# EAGLE design h-bridge driver general AB (EAGLE 7.7.0)
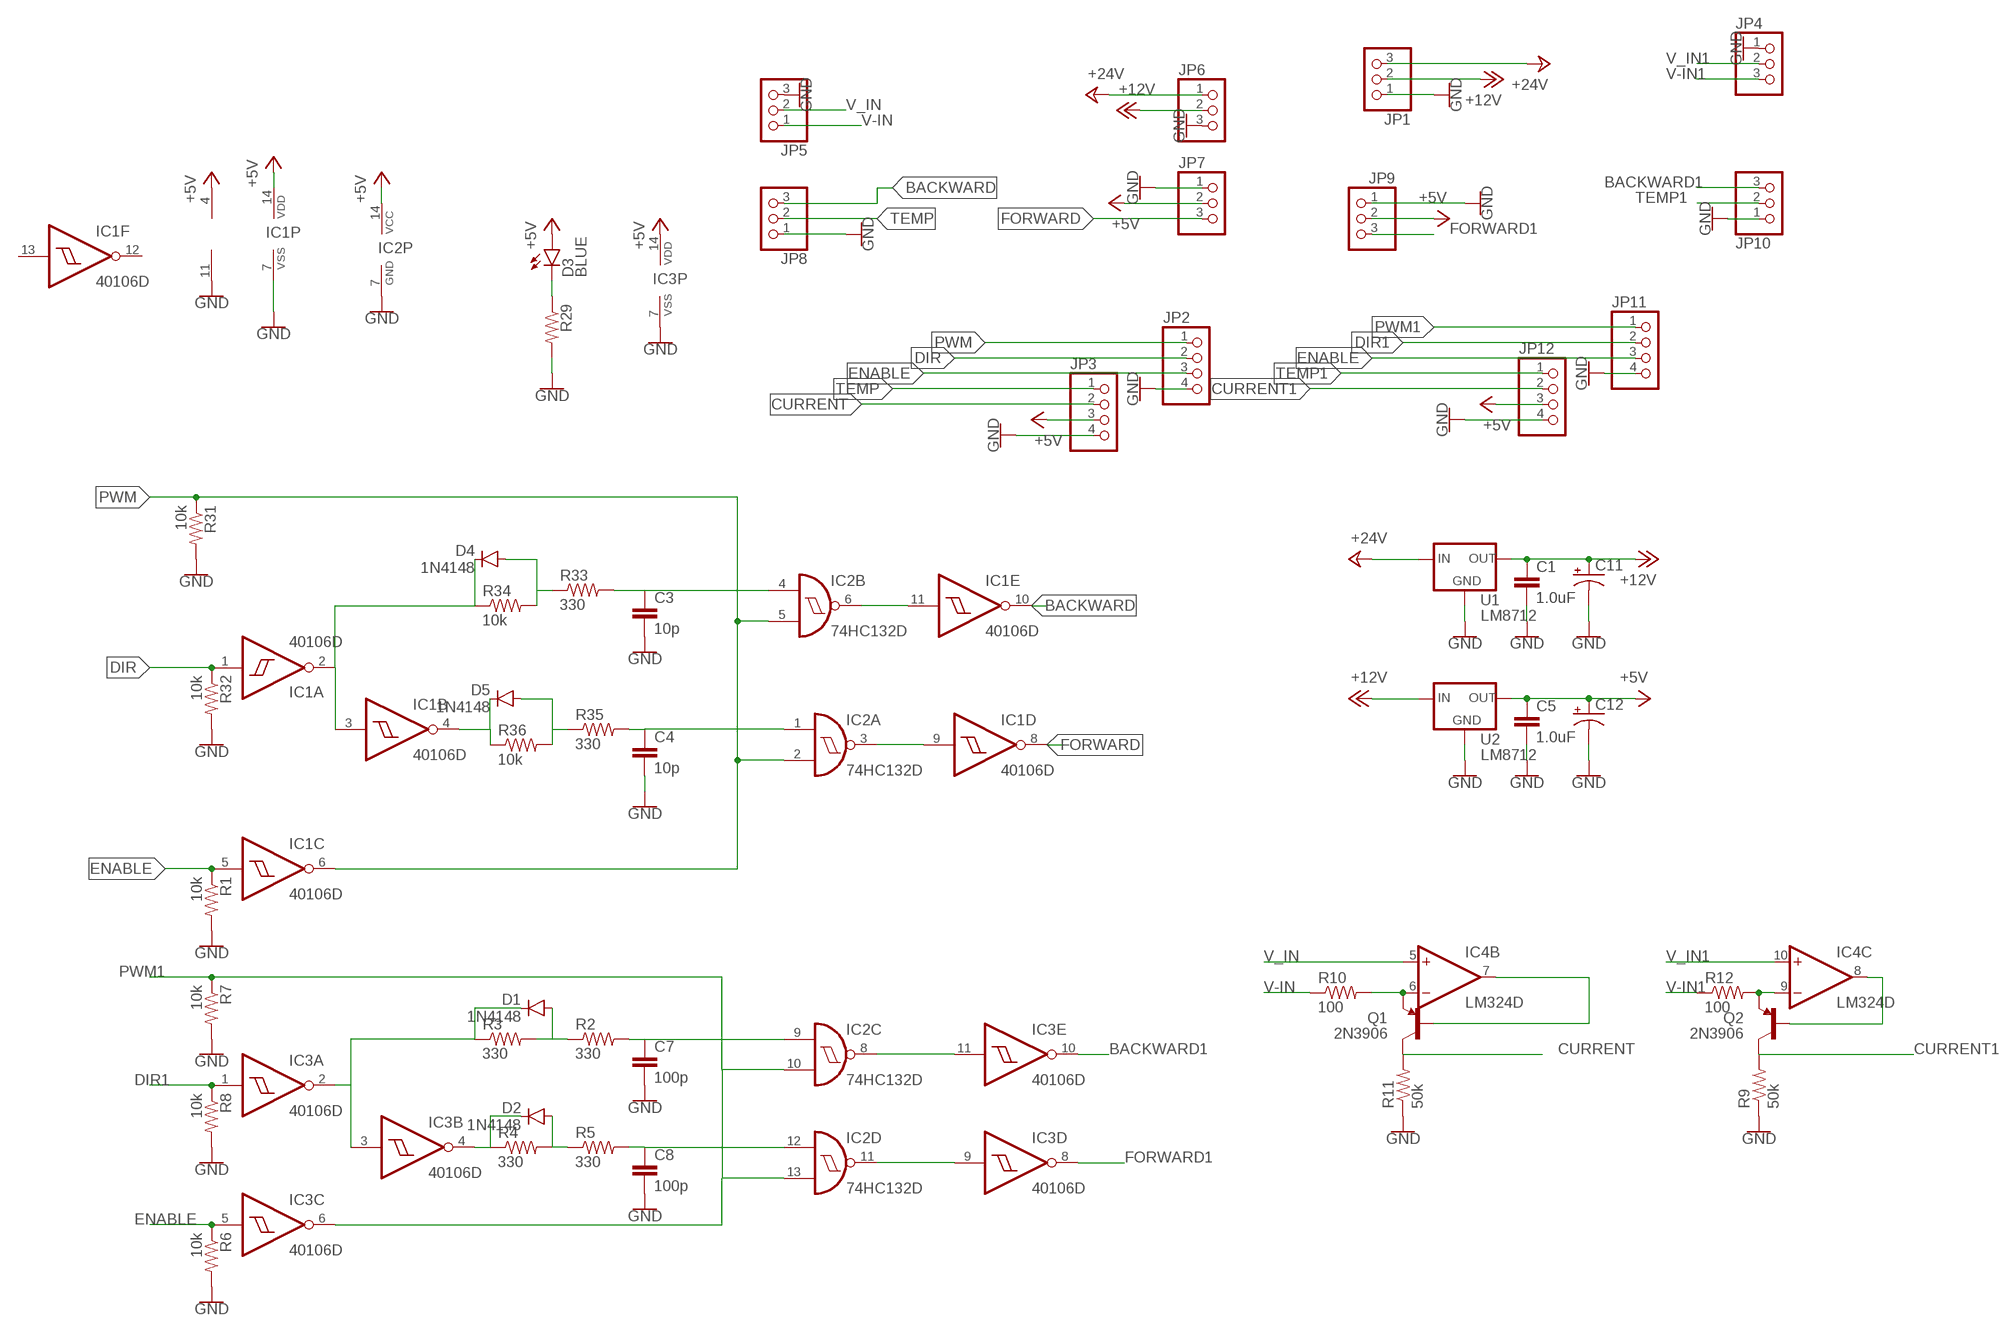
[diagram p0: schematic, sheet 1]

## Parts
C1  1.0uF  1.0UF50V10%(1206)  [1206]
C3  10p  1.0UF-25V-+80/-20(0805)"  [0805-CAP]
C4  10p  1.0UF-25V-+80/-20(0805)"  [0805-CAP]
C5  1.0uF  1.0UF50V10%(1206)  [1206]
C7  100p  1.0UF-25V-+80/-20(0805)"  [0805-CAP]
C8  100p  1.0UF-25V-+80/-20(0805)"  [0805-CAP]
C11  CAP_POLPTH4  [CPOL-RADIAL-1000UF-25V]
C12  CAP_POLPTH4  [CPOL-RADIAL-1000UF-25V]
D1  1N4148  DIODESOD123  [SOD-123]
D2  1N4148  DIODESOD123  [SOD-123]
D3  BLUE  LED-BLUE1206  [LED-1206]
D4  1N4148  DIODESOD123  [SOD-123]
D5  1N4148  DIODESOD123  [SOD-123]
IC1  40106D  [SO14]
IC2  74HC132D  [SO14]
IC3  40106D  [SO14]
IC4  LM324D  [SO14]
JP1  PINHD-1X3  [1X03]
JP2  PINHD-1X4  [1X04]
JP3  PINHD-1X4  [1X04]
JP4  PINHD-1X3  [1X03]
JP5  PINHD-1X3  [1X03]
JP6  PINHD-1X3  [1X03]
JP7  PINHD-1X3  [1X03]
JP8  PINHD-1X3  [1X03]
JP9  PINHD-1X3  [1X03]
JP10  PINHD-1X3  [1X03]
JP11  PINHD-1X4  [1X04]
JP12  PINHD-1X4  [1X04]
Q1  2N3906  TRANSISTOR_PNPMMBT4403  [SOT23-3]
Q2  2N3906  TRANSISTOR_PNPMMBT4403  [SOT23-3]
R1  10k  0.3OHM-1/8W-1%(0805)  [0805]
R2  330  0.3OHM-1/8W-1%(0805)  [0805]
R3  330  0.3OHM-1/8W-1%(0805)  [0805]
R4  330  0.3OHM-1/8W-1%(0805)  [0805]
R5  330  0.3OHM-1/8W-1%(0805)  [0805]
R6  10k  0.3OHM-1/8W-1%(0805)  [0805]
R7  10k  0.3OHM-1/8W-1%(0805)  [0805]
R8  10k  0.3OHM-1/8W-1%(0805)  [0805]
R9  50k  0.3OHM-1/8W-1%(0805)  [0805]
R10  100  0.3OHM-1/8W-1%(0805)  [0805]
R11  50k  0.3OHM-1/8W-1%(0805)  [0805]
R12  100  0.3OHM-1/8W-1%(0805)  [0805]
R29  0.3OHM-1/8W-1%(0805)  [0805]
R31  10k  0.3OHM-1/8W-1%(0805)  [0805]
R32  10k  0.3OHM-1/8W-1%(0805)  [0805]
R33  330  0.3OHM-1/8W-1%(0805)  [0805]
R34  10k  0.3OHM-1/8W-1%(0805)  [0805]
R35  330  0.3OHM-1/8W-1%(0805)  [0805]
R36  10k  0.3OHM-1/8W-1%(0805)  [0805]
U1  LM8712  V_REG_78XXSIDE  [78XXL]
U2  LM8712  V_REG_78XXSIDE  [78XXL]

## Nets
+5V: C5.1 C12.+ D3.A IC1.14(P:VDD) IC2.14(P:VCC) IC3.14(P:VDD) IC4.4(P:V+) JP3.3 JP7.2 JP9.2 JP12.3 U2.OUT
+12V: C1.1 C11.+ JP1.2 JP6.2 U1.OUT U2.IN
+24V: JP1.3 JP6.1 U1.IN
BACKWARD: IC1.10(E:O) JP8.3
BACKWARD1: IC3.10(E:O) JP10.3
CURRENT: JP3.2 Q1.3(C) R11.2
CURRENT1: JP12.2 Q2.3(C) R9.2
DIR: IC1.1(A:I) JP2.2 R32.1
DIR1: IC3.1(A:I) JP11.2 R8.1
ENABLE: IC1.5(C:I) IC3.5(C:I) JP2.3 JP11.3 R1.1 R6.1
FORWARD: IC1.8(D:O) JP7.3
FORWARD1: IC3.8(D:O) JP9.3
GND: C1.2 C3.2 C4.2 C5.2 C7.2 C8.2 C11.- C12.- IC1.7(P:VSS) IC2.7(P:GND) IC3.7(P:VSS) IC4.11(P:V-) JP1.1 JP2.4 JP3.4 JP4.1 JP5.3 JP6.3 JP7.1 JP8.1 JP9.1 JP10.1 JP11.4 JP12.4 R1.2 R6.2 R7.2 R8.2 R9.1 R11.1 R29.2 R31.2 R32.2 U1.GND U2.GND
N$1: IC1.11(E:I) IC2.6(B:O)
N$2: IC1.9(D:I) IC2.3(A:O)
N$3: IC2.8(C:O) IC3.11(E:I)
N$4: IC2.11(D:O) IC3.9(D:I)
N$6: C7.1 IC2.9(C:I0) R2.2
N$7: D3.C R29.1
N$8: D1.A R2.1 R3.2
N$9: D1.C IC3.2(A:O) IC3.3(B:I) R3.1
N$10: IC4.6(B:-IN) Q1.2(E) R10.2
N$11: D2.C IC3.4(B:O) R4.1
N$12: D2.A R4.2 R5.1
N$13: C8.1 IC2.12(D:I0) R5.2
N$14: IC4.7(B:OUT) Q1.1(B)
N$15: IC4.9(C:-IN) Q2.2(E) R12.2
N$17: IC4.8(C:OUT) Q2.1(B)
N$33: D4.C IC1.2(A:O) IC1.3(B:I) R34.1
N$34: D4.A R33.1 R34.2
N$35: C3.1 IC2.4(B:I0) R33.2
N$39: C4.1 IC2.1(A:I0) R35.2
N$40: D5.A R35.1 R36.2
N$41: D5.C IC1.4(B:O) R36.1
PWM: IC1.6(C:O) IC2.2(A:I1) IC2.5(B:I1) JP2.1 R31.1
PWM1: IC2.10(C:I1) IC2.13(D:I1) IC3.6(C:O) JP11.1 R7.1
TEMP: JP3.1 JP8.2
TEMP1: JP10.2 JP12.1
V-IN: JP5.1 R10.1
V-IN1: JP4.3 R12.1
V_IN: IC4.5(B:+IN) JP5.2
V_IN1: IC4.10(C:+IN) JP4.2
Unconnected: IC1.12(F:O) IC1.13(F:I) IC3.12(F:O) IC3.13(F:I) IC4.1(A:OUT) IC4.2(A:-IN) IC4.3(A:+IN) IC4.12(D:+IN) IC4.13(D:-IN) IC4.14(D:OUT)

## Library data of the parts
C1 C5 = SparkFun-Capacitors:1.0UF50V10%(1206): CAP-09822; PROD_ID: CAP-09822
C3 C4 C7 C8 = SparkFun-Capacitors:1.0UF-25V-+80/-20(0805): CAP-11625
C11 C12 = SparkFun-Capacitors:CAP_POL: Capacitor Polarized These are standard SMD and PTH capacitors. Normally 10uF, 47uF, and 100uF in electrolytic and tantalum varieties. Always verify the external diameter of the through hole cap, it varies with capacity, voltage, and manufacturer. The EIA devices should be standard.
D1 D2 D4 D5 = SparkFun-DiscreteSemi:DIODE: Diode These are standard reverse protection diodes and small signal diodes. SMA package can handle up to about 1A. SOD-323 can handle about 200mA. What the SOD-323 package when ordering, there are some mfgs out there that are 5-pin packages.
D3 = SparkFun-LED:LED-BLUE: Blue LEDs for production use Various blue LEDs stocked by SparkFun production 0603 - DIO-08575 Rebel - DIO-09553 1206 - DIO-09911; PROD_ID: DIO-09911
IC1 IC3 = 40xx:40106: Hex SCHMITT TRIGGER
IC2 = 74xx-eu:74*132: Quad 2-input NAND schmitt trigger
IC4 = linear:LM324: OP AMP
JP1 JP4-JP10 = pinhead:PINHD-1X3: PIN HEADER
JP2 JP3 JP11 JP12 = pinhead2:PINHD-1X4: PIN HEADER
Q1 Q2 = SparkFun-DiscreteSemi:TRANSISTOR_PNP: Generic PNP BJT Double check pinouts against datasheets- not all devices are the same! MMBT3906 - 40V 200mA SOT-23 (TRANS-08052) MMBT4403 - 40V 600mA SOT-23 (TRANS-09245); PROD_ID: TRANS-09245; VALUE: MMBT4403
R1-R12 R29 R31-R36 = SparkFun-Resistors:0.3OHM-1/8W-1%(0805): RES-11622; PROD_ID: RES-11622; VALUE: 0.3
U1 U2 = SparkFun-PowerIC:V_REG_78XX: Voltage Regulator Standard 78xx regulator. IGO (Input Ground Output). Spark Fun Electronics SKU : COM-00107

## Board
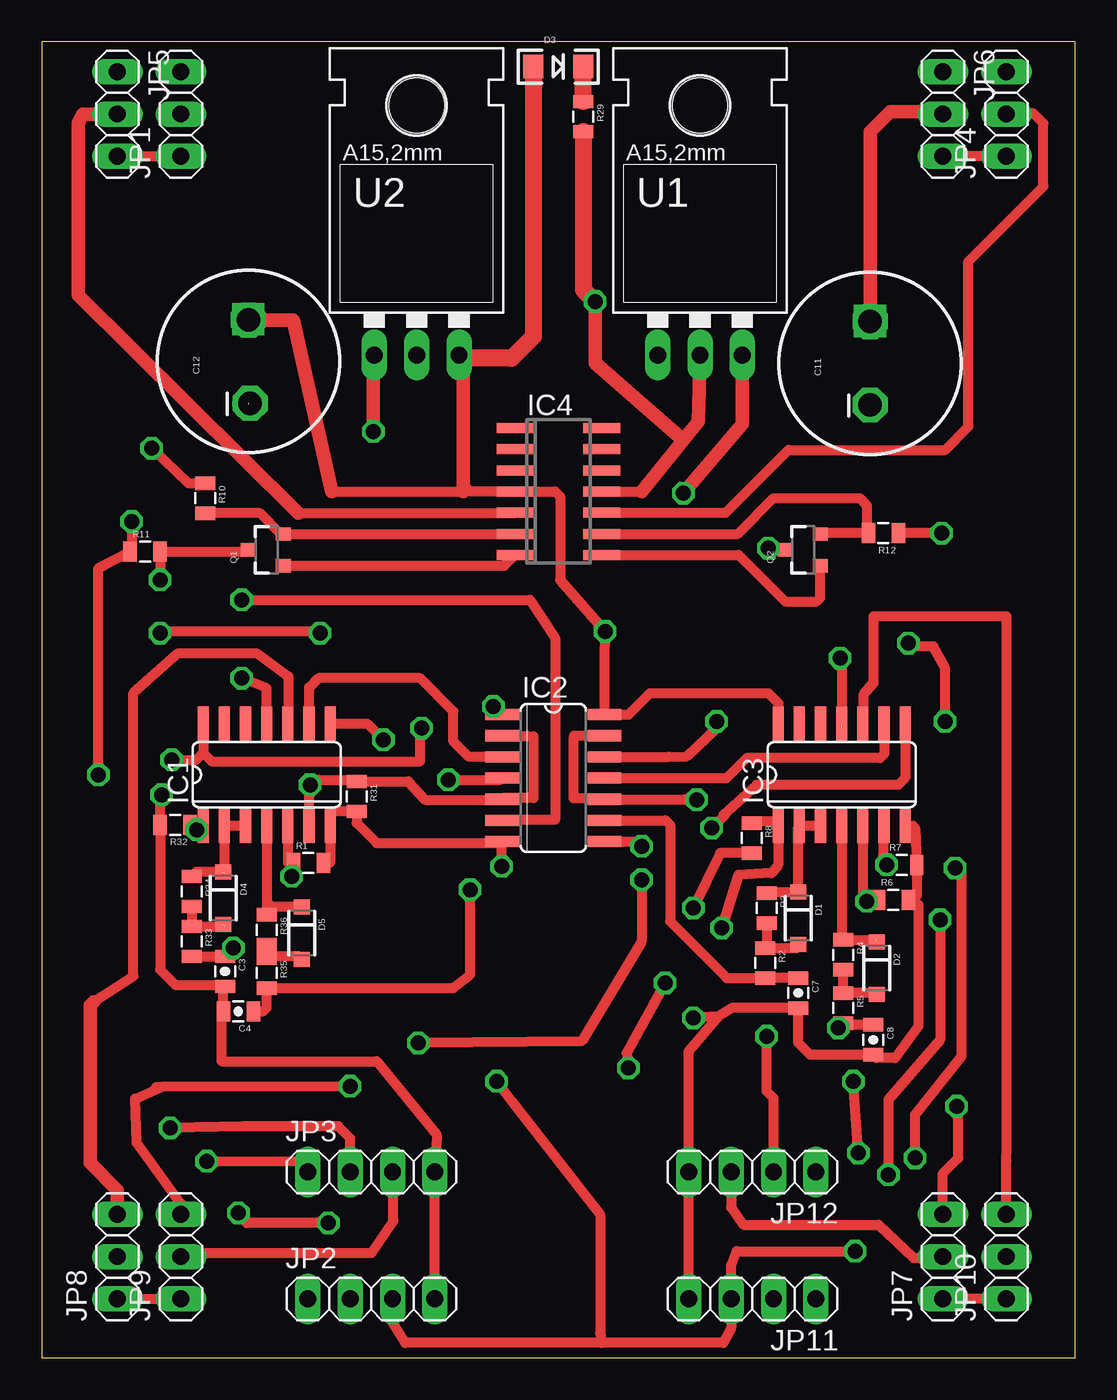
[diagram p1: board, top side]
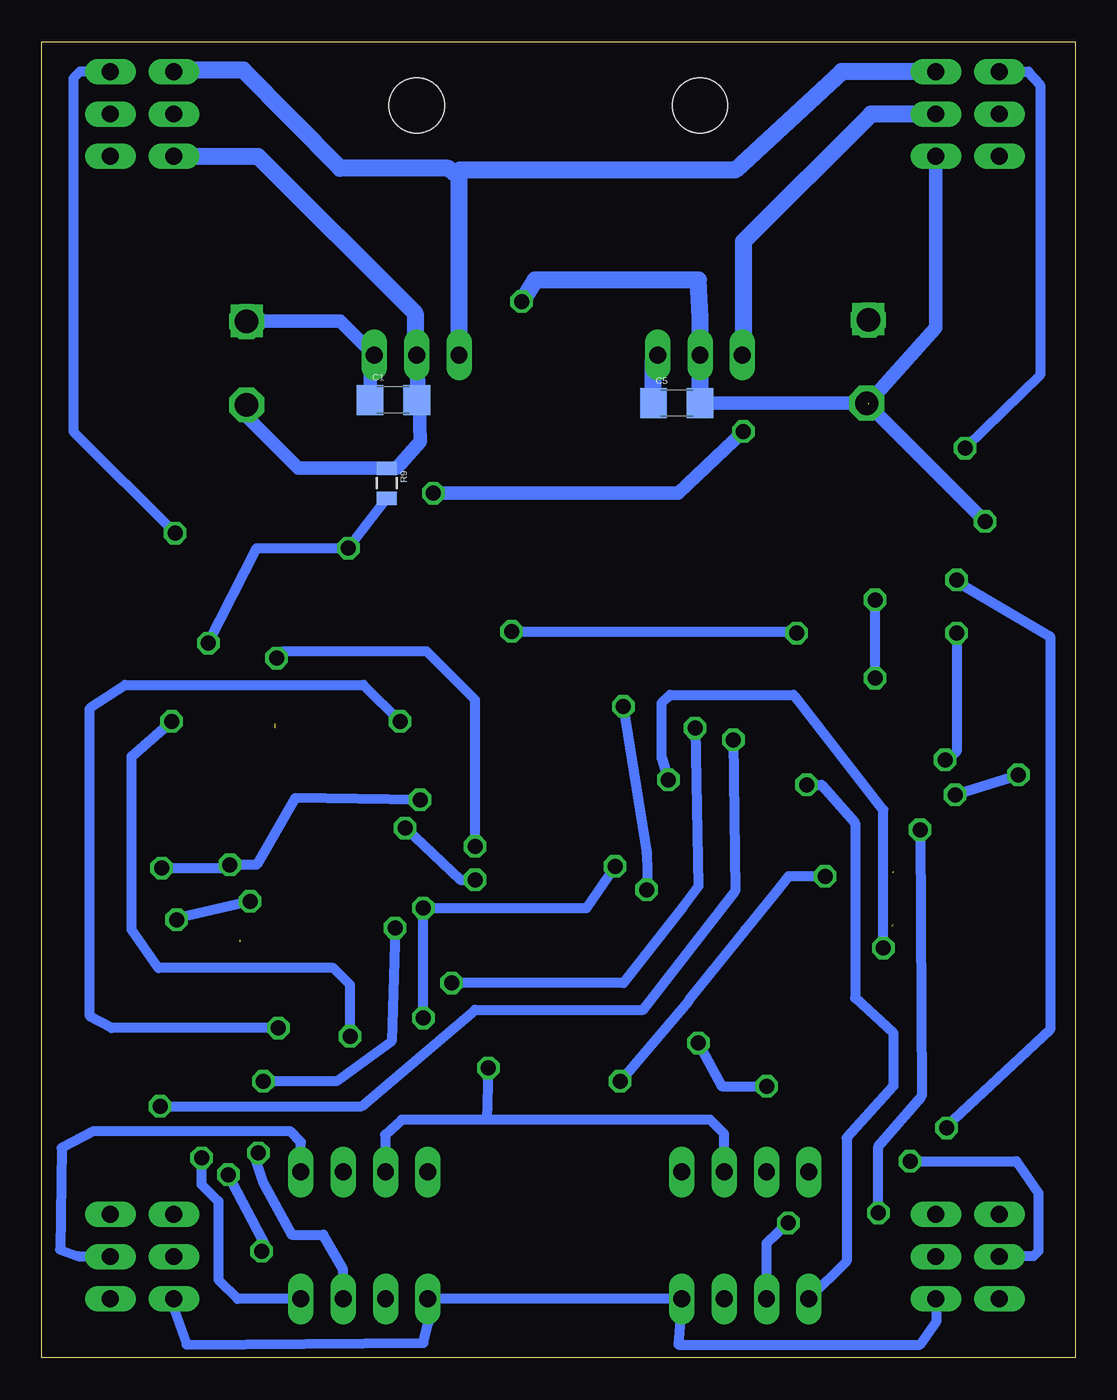
[diagram p2: board, bottom side, seen from below]

Size 62 x 79 mm. Coordinates in mm from the lower left corner, seen from the top.
Outline: 0,0 62,0 62,79 0,79 0,0
Copper layers (1*16): Top 0.035mm / dielectric 1.5mm / Bottom 0.035mm
Design rules "default": minimum track width 10mil, minimum drill 24mil, track to track 8mil, track to pad 8mil, pad to pad 8mil, via to via 8mil, smd to smd 8mil, copper to edge 40mil, drill to drill 8mil, minimum pad ring 10mil, minimum via ring 8mil, stop-mask expansion 4mil, vias tented up to drill 0mil, thermal gap 10mil

### Footprints (pad centres in the part's own frame; a part is rotated, then mirrored left to right if it is on the bottom)
1206 = smd 1.6 x 1.8: 1 -1.4,0; 2 1.4,0
0805-CAP = smd 0.8 x 1.2: 1 -0.9,0; 2 0.9,0
CPOL-RADIAL-1000UF-25V = drill 0.9 pad 1.93 square: + 2.54,0 | drill 0.9 pad 1.93: - -2.54,0
SOD-123 = smd 0.9 x 0.95: A 1.575,0; C -1.575,0
LED-1206 = smd 1.2 x 1.4: A -1.5,0; C 1.5,0
SO14 = smd 0.66 x 2.032: 1 -3.81,-3.073; 2 -2.54,-3.073; 3 -1.27,-3.073; 4 0,-3.073; 5 1.27,-3.073; 6 2.54,-3.073; 7 3.81,-3.073; 8 3.81,3.073; 9 2.54,3.073; 10 1.27,3.073; 11 0,3.073; 12 -1.27,3.073; 13 -2.54,3.073; 14 -3.81,3.073
SO14' = smd 0.6 x 2.2: 1 -3.81,-2.6; 2 -2.54,-2.6; 3 -1.27,-2.6; 4 0,-2.6; 5 1.27,-2.6; 6 2.54,-2.6; 7 3.81,-2.6; 8 3.81,2.6; 9 2.54,2.6; 10 1.27,2.6; 11 0,2.6; 12 -1.27,2.6; 13 -2.54,2.6; 14 -3.81,2.6
1X03 = drill 1.016 long: 1 -2.54,0; 2 0,0; 3 2.54,0
1X04 = drill 1.016 long: 1 -3.81,0; 2 -1.27,0; 3 1.27,0; 4 3.81,0
SOT23-3 = smd 0.8 x 0.9: 1 -0.95,-1; 2 0.95,-1; 3 0,1.1
0805 = smd 0.8 x 1.2: 1 -0.9,0; 2 0.9,0
78XXL = drill 1.016 long: GND 0,-3.81; IN -2.54,-3.81; OUT 2.54,-3.81 | hole 3.302: 0,11.176

### Placement (x,y rotation side)
C1  40.9,57.5 0 bottom
C3  11,23.2 270 top
C4  11.8,20.8 180 top
C5  23.9,57.3 0 bottom
C7  45.4,21.9 270 top
C8  49.9,19.1 270 top
C11  49.7,59.7 90 top
C12  12.4,59.8 90 top
D1  45.4,26.4 270 top
D2  50.1,23.4 270 top
D3  31,77.5 0 top
D4  10.9,27.6 270 top
D5  15.6,25.5 270 top
IC1  13.5,35 0 top
IC2  30.7,34.8 270 top
IC3  48,35 0 top
IC4  LM324D  [SO14']  31,52 270 top
JP1  8.35,74.66 90 top
JP2  19.78,3.54 0 top
JP3  19.78,11.16 0 top
JP4  57.88,74.66 90 top
JP5  4.54,74.66 270 top
JP6  54.07,74.66 270 top
JP7  54.07,6.08 90 top
JP8  4.54,6.08 90 top
JP9  8.35,6.08 90 top
JP10  57.88,6.08 90 top
JP11  42.64,3.54 180 top
JP12  42.64,11.16 180 top
Q1  13.5,48.5 90 top
Q2  45.7,48.5 90 top
R1  16,29.7 0 top
R2  43.4,23.7 270 top
R3  43.5,27 270 top
R4  48.1,24.2 270 top
R5  48.1,21 270 top
R6  51.1,27.5 0 top
R7  51.6,29.6 0 top
R8  42.6,31.2 270 top
R9  41.3,52.5 270 bottom
R10  9.8,51.6 270 top
R11  6.2,48.4 0 top
R12  50.5,49.5 180 top
R29  32.5,74.5 270 top
R31  18.9,33.7 270 top
R32  8,32 180 top
R33  9,25 270 top
R34  9,28 270 top
R35  13.5,23.1 270 top
R36  13.5,25.7 270 top
U1  39.5,64 0 top
U2  22.5,64 0 top

### Tracks (layer width: path | path; a pad name or v marks a point on that pad's centre or on a via)
+5V  (via drill 0.9, 1.4)
  Top 0.61: IC1.14 9.69,36.31 | 9.69,36.31 10.2,35.8 22.7,35.8 22.7,37.7 v22.8,37.8 | IC3.14 44.2,38.08 44.2,39.3 43.6,39.9 36.5,39.9 35.21,38.61 IC2.14 33.77,41.83 v33.8,43.6 31.1,46.7 31.1,51.7 30.8,52 IC4.4 25.7,52 25.3,52.4 | v16.7,43.5 16.6,43.6 7.2,43.6 v7.1,43.5 | v7.8,35.9 9.28,35.9 9.69,36.31 | JP9.2 9.08,6.08 9.9,6.3 19.8,6.3 21.1,8.2 21.1,11.11 JP3.3 | JP12.3 41.37,9.03 42.1,8 50.2,8 52.3,6 54.7,6 54.8,5.9 54.25,5.9 JP7.2 | v37.4,22.5 35.1,18.3 v35.2,17.4 | 25.3,59.93 U2.OUT | 17.4,52 25.3,52
  Top 0.813: 25.3,59.93 25.3,52.4 25.3,52 | C12.+ v12.4,62.3 15.1,62.3 17.4,52
  Top 1.016: D3.A 29.5,61.3 28.2,60 25.23,60 U2.OUT
  Bottom 0.61: v33.8,43.6 16.9,43.6 v16.7,43.5 | v7.1,43.5 7.1,36.4 7.4,36.1 7.7,36 v7.8,35.9 | JP3.3 21.05,13.45 21.9,14.3 35.3,14.3 | 35.3,14.3 40.4,14.3 41.4,13.4 41.4,11.19 JP12.3 | v22.8,37.8 22.6,28.3 23.5,27.1 27.1,22.5 v37.4,22.5 37.5,22.5 | v35.2,17.4 35.3,14.3
  Bottom 1.016: C5.1 25.3,59.93 U2.OUT
+12V  (via drill 0.9)
  Top 0.813: C11.+ 49.7,73.6 50.9,74.8 53.93,74.8 JP6.2 | U1.OUT 42.04,56.04 v38.5,51.9 | v19.9,55.6 19.9,60.13 U2.IN
  Bottom 0.813: C1.1 42.3,59.93 | C11.+ 44.09,62.24 U1.OUT | v38.5,51.9 23.8,51.9 v19.9,55.6
  Bottom 1.016: JP1.2 12.24,74.66 19.9,67 19.9,60.25 U2.IN | 42.3,59.93 U1.OUT
+24V
  Bottom 1.016: U1.IN 36.96,70.86 | 36.96,70.86 37.6,71.4 44.1,71.4 49.9,77.3 53.97,77.3 JP6.1 | JP1.3 14,77.2 20.4,71.3 36.9,71.3 36.96,70.86
BACKWARD
  Top 0.61: 3.04,21.36 3.11,21.36 5.5,22.9 5.5,39.9 8.2,42.3 12.9,42.3 14.8,40.9 14.8,38.24 IC1.10
  Top 0.813: JP8.3 4.54,10.06 2.9,11.7 2.9,21.14 3.11,21.36
BACKWARD1
  Top 0.61: IC3.10 49.3,39.8 49.9,40.5 49.9,44.5 57.9,44.5 57.9,12.6 57.88,11.82 JP10.3
CURRENT  (via drill 0.9)
  Top 0.61: JP3.2 18.51,13.19 17.8,13.9 12.1,13.9 v7.7,13.8 | Q1.3 12.3,48.4 R11.2 v7.1,46.7
  Bottom 0.61: v7.7,13.8 7.7,13.9 1.5,19.7 1.5,43.3 7.1,46.6 v7.1,46.7
CURRENT1  (via drill 0.9)
  Top 0.61: JP12.2 43.91,15.59 43.5,16 v43.5,19.3 | v54.2,38.2 54.2,41.4 53.5,42.7 52.2,42.7 v52,42.9 | v43.6,48.6 44.5,48.6 Q2.3
  Bottom 0.61: v43.5,19.3 43.5,22.4 44.5,23.4 55,23.4 56.6,25.7 56.6,36.1 v54.2,38.2 | R9.2 41.4,51.5 v43.6,48.6 49.1,48.6 v52,42.9
DIR  (via drill 0.9)
  Top 0.61: R32.1 9.32,31.5 IC1.1 9.69,31.49 v9.3,31.7 | v17.2,8.1 12.3,8.1 v11.8,8.7
  Bottom 0.61: v9.3,31.7 9.2,15.7 11.8,12.7 v11.8,8.7 | JP2.2 18.51,6.89 v17.2,8.1
DIR1  (via drill 0.9)
  Top 0.61: R8.1 42.7,32.2 44.1,32.2 44.19,32.11 IC3.1 44.19,29.59 43.8,29.1 41.8,29 v40.8,25.8 | v49,12.3 v48.7,16.6
  Bottom 0.61: JP11.2 43.91,5.31 45.1,7.4 47,7.4 48.7,10.5 49.3,12.3 v49,12.3 | v40.8,25.8 41,19 44.3,16.6 v48.7,16.6
ENABLE  (via drill 0.9)
  Top 0.61: IC1.5 14.77,29.73 R1.1 v15,28.9 | IC3.5 49.27,27.53 | 49.27,27.53 R6.1 | 33.6,0.9 40.9,0.9 41.37,1.77 JP11.3 41.37,5.57 41.7,6.4 v48.8,6.4 | 33.6,0.9 21.8,0.9 21,2.2 21,3.49 JP2.3 | 49.27,27.53 49.27,27.13 v49.5,27.4 | v53.9,26.3 53.9,19.1 50.8,15.5 v50.8,11 | v27.3,16.6 28.2,15.4 33.5,8.6 33.5,1.5 33.6,0.9
  Bottom 0.61: v15,28.9 17.2,28.9 18,27.9 19.8,25.7 23.1,21.6 23.2,21.4 v27.3,16.6 | v49.5,27.4 53.4,26.5 v53.9,26.3 | v48.8,6.4 48.5,6.6 v50.8,11
FORWARD  (via drill 0.9)
  Top 0.61: IC1.8 19.53,38.07 v20.5,37.1 | JP7.3 54.07,11.07 55,12 55,15 v54.9,15.1
  Bottom 0.61: v20.5,37.1 20.4,28 25.9,20.9 36,20.9 42.8,15.1 v54.9,15.1
FORWARD1  (via drill 0.9)
  Top 0.61: IC3.8 51.81,34.81 51.4,34.4 42.9,34.4 40.9,32.6 41,32.6 v40.2,31.8 | v36,28.7 36,25 32.4,19 v22.6,18.9 | v18.5,16.3 7.2,16.25 | 7.2,16.25 6.85,16.25 | JP9.3 8.35,9.25 5.7,12.9 5.6,15.56 7.2,16.25
  Bottom 0.61: v40.2,31.8 36.9,28.7 v36,28.7 | v22.6,18.9 21.2,16.3 v18.5,16.3
GND  (via drill 0.9, 1.4)  (1 unrouted)
  Top 0.61: R1.2 17.31,29.71 IC1.7 17.3,32.6 17.5,32.8 R31.2 18.9,32.1 20.1,30.9 27.54,30.9 IC2.7 27.6,30.96 v27.6,29.5 | JP8.1 JP9.1 | JP10.1 JP7.1 | JP5.3 JP1.1 | JP4.1 JP6.3 | 52.3,27.5 52.5,27.7 R7.2 52.4,31.8 52.27,31.93 IC3.7 | R8.2 40.7,30.3 v39.1,27 | R6.2 52.3,27.5 | 52.3,27.5 52.6,27.2 52.6,19.9 51.2,18 50.1,18 C8.2 46.1,18.2 45.4,18.9 C7.2 41.4,21 40.6,20.5 | 40.6,20.5 38.83,18.43 JP12.4 JP11.4 | 40.6,20.5 v39.1,20.4 | JP2.4 JP3.4 23.7,13.4 20.1,17.8 10.8,17.8 10.8,20.7 C4.2 10.9,22.2 C3.2 10.9,22.4 8,22.4 7.1,23.3 R32.2 7.1,33.4 v7.2,33.8 | v3.4,35 3.4,47.4 R11.1 5.4,48.5 v5.4,50.2 | IC4.11 36,52
  Top 0.813: 36,52 38.01,54.48 | 38.01,54.48 39.4,56.2 U1.GND | 38.01,54.48 38.51,55.09 33.2,59.7 v33.2,63.4
  Top 1.016: R29.2 32.5,64.1 v33.2,63.4
  Bottom 0.61: v27.6,29.5 29.3,27 v39.1,27 v39.1,20.4 | JP7.1 54.07,2.97 53.3,0.8 39.1,0.9 38.8,2.1 38.8,3.51 JP11.4 JP2.4 23.59,3.39 23.8,0.8 9.3,0.8 8.3,2.2 8.3,3.49 JP9.1 | v7.2,33.8 6.9,33.9 v3.4,35 | 12.4,57.3 v12.5,57.3 | R9.1 40.7,53.4 | 39.4,59.3 39.5,59.4
  Bottom 0.813: C1.2 39.5,59.4 | C5.2 12.4,57.3 8.35,61.85 JP1.1 | v12.5,57.3 v5.4,50.2 | C11.- 49.7,56.5 46.6,53.4 R9.1 | 40.7,53.4 39.3,55 39.4,59.3
  Bottom 1.016: C5.2 U2.GND 22.5,62.4 22.6,64.7 32.4,64.7 v33.2,63.4 | 39.5,59.4 39.5,59.7 | 39.5,59.7 U1.GND | JP6.3 49.02,72.12 39.6,62.7 39.6,59.8 39.5,59.7
N$1  (via drill 0.9)
  Top 0.61: IC1.11 13.5,40.2 v12,40.8 | v12,45.5 29.3,45.5 30.8,43.2 30.8,32.3 27.67,32.3 IC2.6
  Bottom 0.61: v12,40.8 v12,45.5
N$2
  Top 0.61: IC1.9 16.04,40.24 16.6,40.8 22.7,40.8 24.7,38.8 24.7,37 25.63,36.07 IC2.3
N$3  (via drill 0.9)  (1 unrouted)
  Top 0.61: IC2.8 35.71,30.99 v36,30.7 | v47.9,42 48,41.9 48,37.8
  Bottom 0.61: v36,30.7 36,39.5 38.9,42.4 47.5,42.4 v47.9,42
N$4
  Top 0.61: IC3.9 50.54,36.24 50.3,36 42.3,36 41.1,34.8 IC2.11
N$5  (via drill 1.4)
  other vias: 49.7,62.2
N$6
  Top 0.61: C7.1 R2.2 41.1,22.8 37.7,26.2 37.7,32 37.44,32.26 IC2.9
N$7
  Top 1.016: R29.1 D3.C
N$8
  Top 0.61: R3.2 43.5,24.7 R2.1 45.27,24.6 45.27,24.7 D1.A
N$9
  Top 0.61: 45.5,31.89 IC3.2 | IC3.3 IC3.2 | R3.1 43.58,27.98 D1.C 45.4,31.87 IC3.2
N$10
  Top 0.61: IC4.6 Q1.2 14.35,49.45 13.1,50.7 R10.2
N$11  (1 unrouted)
  Top 0.61: IC3.4 48,25.2 R4.1 50.08,25.1
N$12
  Top 0.61: R4.2 R5.1 48.12,21.93 50,21.93 D2.A
N$13  (via drill 0.9)
  Top 0.61: C8.1 48.2,20 R5.2 v47.8,19.8 | IC2.12 37.63,36.07 38.7,36.1 40.5,37.8 v40.5,38.2
  Bottom 0.61: v47.8,19.8 57.8,19.8 59.1,20.5 59.1,39 57,40.4 42.7,40.4 v40.5,38.2
N$14
  Top 0.61: Q1.1 27.76,47.55 IC4.7
N$15
  Top 0.61: Q2.2 46.75,49.5 R12.2 49.5,49.6 49.5,51.2 49.1,51.6 43.9,51.6 41.76,49.46 IC4.9
N$16  (via drill 1.4)
  other vias: 49.7,57.2
N$17
  Top 0.61: IC4.8 41.81,48.19 44.6,45.4 46.5,45.4 46.7,45.6 Q2.1
N$33  (1 unrouted)
  Top 0.61: IC1.3 IC1.2 10.96,29.11 | 9.18,29.07 R34.1 9.28,29.18 D4.C
N$34  (1 unrouted)
  Top 0.61: R34.2 R33.1 10.97,25.9
N$35  (via drill 0.9)
  Top 0.61: R33.2 C3.1 v11.5,24.6 | v24.4,34.7 27.53,34.7 IC2.4
  Bottom 0.61: v11.5,24.6 11.5,32.9 16.8,39.7 16.9,39.8 24.3,39.8 24.8,39.3 24.8,36 v24.4,34.7
N$39  (via drill 0.9)
  Top 0.61: C4.1 13.3,20.8 13.5,21 R35.2 24.7,22.2 25.7,23 v25.7,28.1 | IC2.1 27.11,38.71 v27.1,39.1
  Bottom 0.61: v27.1,39.1 25.7,30.3 25.64,28.11 25.75,28.1 v25.7,28.1
N$40
  Top 0.61: R36.2 R35.1 13.62,24.12 15.4,24.12 D5.A
N$41
  Top 0.61: 13.5,26.9 13.57,27.3 13.8,27.07 D5.C | IC1.4 13.5,26.9 | 13.5,26.9 R36.1
PWM  (via drill 0.9)
  Top 0.61: 16.04,33.46 16.04,34.14 16.6,34.7 18.8,34.7 R31.1 22,34.6 23,33.5 27.6,33.5 IC2.5 27.7,33.6 29.5,33.6 29.5,37.3 29.16,37.34 IC2.2 | IC1.6 16.04,33.46 | 16.04,33.46 v16.1,34.4
  Bottom 0.61: v16.1,34.4 15.2,34.4 13.2,32.1 13.2,21.6 10.9,19.5 10.9,16.3 13.7,13.2 13.7,5.81 JP2.1
PWM1  (via drill 0.9)
  Top 0.61: R7.1 50.5,29.67 IC3.6 | IC2.13 31.94,37.34 31.9,37.2 31.9,33.6 33.7,33.6 IC2.10 38.57,33.53 v39.3,33.5 | v52.4,12 52.4,14.6 55.2,18.1 55.2,29 v54.8,29.4
  Bottom 0.61: v39.3,33.5 46.8,33.6 49.1,29.6 R7.1 50.9,29.4 v54.8,29.4 | JP11.1 50.24,3.54 51.4,4.7 51.4,9.4 52.4,10.4 v52.4,12
  other vias: 50.7,29.6
TEMP  (via drill 0.9)
  Top 0.61: JP3.1 15.56,11.76 v9.9,11.8
  Bottom 0.61: JP8.2 4.52,6.1 2.5,6.1 2.2,6.4 2.2,9.9 3.36,11.56 3.52,11.8 v9.9,11.8
TEMP1
  Bottom 0.61: JP10.2 57.9,6.1 59.8,6.1 60.9,6.5 60.8,12.6 58.9,13.6 47.1,13.6 46.45,12.95 JP12.1
V-IN  (via drill 0.9)
  Top 0.61: v6.6,54.6 8.8,52.5 R10.1
  Bottom 0.61: JP5.1 2.8,77.2 2.1,76.4 2.1,59 v6.6,54.6
V-IN1  (via drill 0.9)
  Top 0.61: v54,49.5 R12.1
  Bottom 0.61: JP4.3 59.7,77.2 60.1,76.8 60.1,55.6 v54,49.5
V_IN
  Top 0.61: 15.4,50.7 28.33,50.7 IC4.5
  Top 0.813: JP5.2 2.46,74.66 2.2,74.1 2.2,63.8 15.4,50.7
V_IN1
  Top 0.61: IC4.10 41.03,50.73 44.8,54.5 54.2,54.5 55.6,55.9 55.6,65.8 60.1,70.3 60.1,74.1 59.5,74.7 57.92,74.7 JP4.2